# Altium schematic sheet power.SchDoc
size A; SheetNumber: 3; SheetTotal: 3
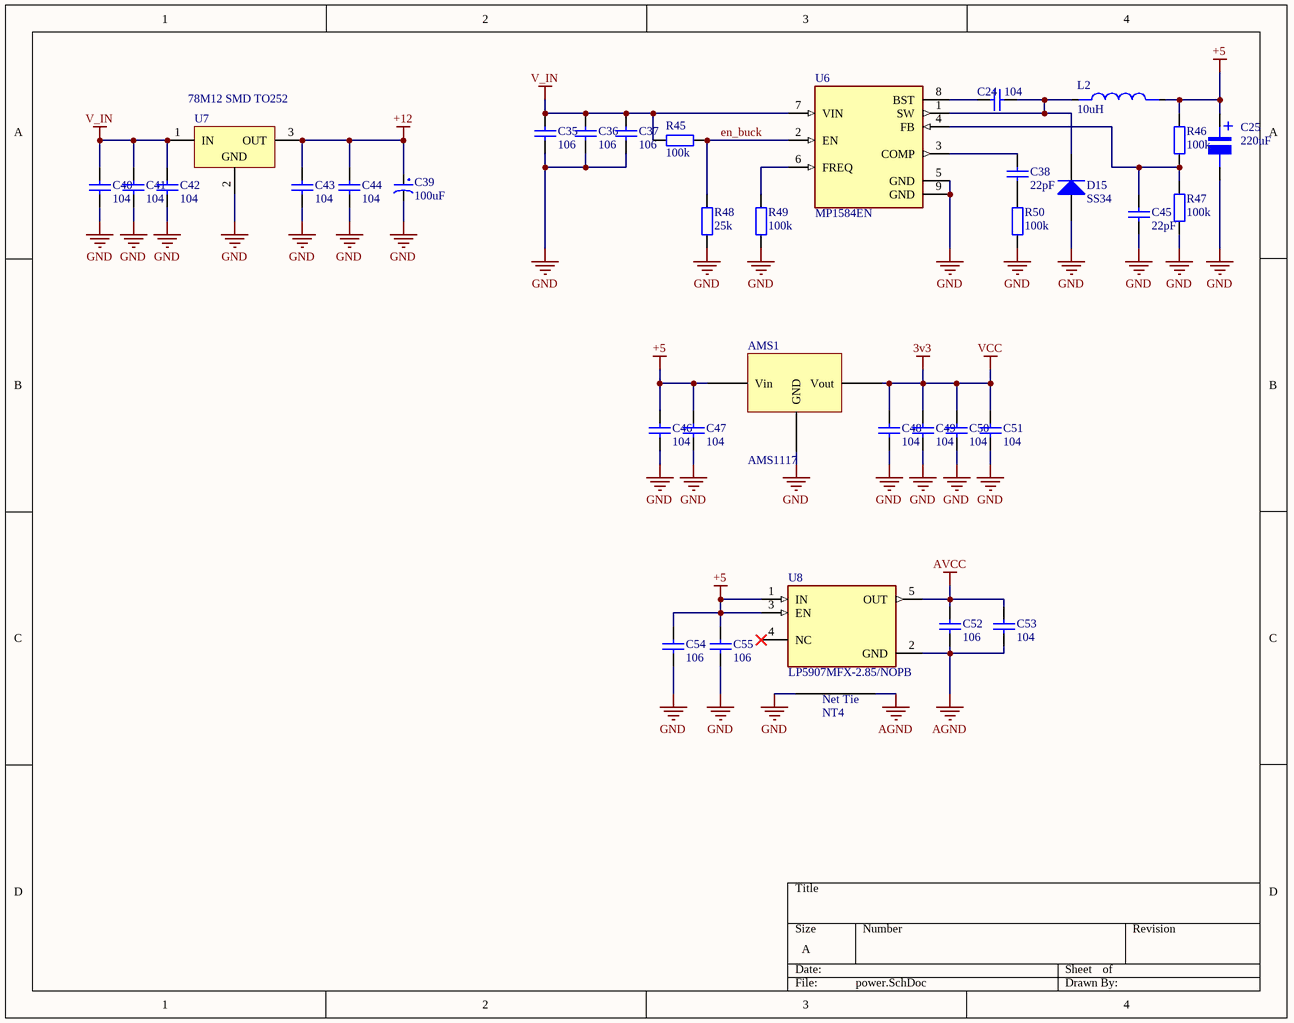
[diagram p0: power.SchDoc]

## Parts
AMS1  AMS1117  [TO 252]
C24  104  [tu 0603]
C25  220uF  [tu nhom 6.3 (d)]
C35  106  [tu 0805]
C36  106  [tu 0805]
C37  106  [tu 0805]
C38  22pF  [tu 0805]
C39  100uF  [tu hoa 8mm]
C40  104  [tu 0603]
C41  104  [tu 0603]
C42  104  [tu 0603]
C43  104  [tu 0603]
C44  104  [tu 0603]
C45  22pF  [tu 0805]
C46  104  [tu 0603]
C47  104  [tu 0603]
C48  104  [tu 0603]
C49  104  [tu 0603]
C50  104  [tu 0603]
C51  104  [tu 0603]
C52  106  [tu 0603]
C53  104  [tu 0603]
C54  106  [tu 0603]
C55  106  [tu 0603]
D15  SS34  [DIODE SMA]
L2  10uH  [CUON CAM SMD 0530]
NT4  2mm  [NetTie_20mil]  (value not drawn)  (net tie, no BOM)
R45  100k  [tro smd 0603]
R46  100k  [tro smd 0603]
R47  100k  [tro smd 0603]
R48  25k  [tro smd 0603]
R49  100k  [tro smd 0603]
R50  100k  [tro smd 0603]
U6  MP1584EN  [SOIC127P600X170-9N]
U7  78M12 SMD TO252  [TO252]
U8  LP5907MFX-2.85/NOPB  [SOT95P280X145-5N]

## Nets
3v3: AMS1.2(Vout) C48.1 C49.1 C50.1 C51.1  [also labelled VCC]
+5: AMS1.3(Vin) C25.1 C46.1 C47.1 C54.1 C55.1 L2.2 R46.2 U8.1(IN) U8.3(EN)
+12: C39.1 C43.1 C44.1 U7.3(OUT)
AGND: C52.2 C53.2 NT4.2 U8.2(GND)
AVCC: C52.1 C53.1 U8.5(OUT)
GND: AMS1.1(GND) C25.2 C35.2 C36.2 C37.2 C39.2 C40.2 C41.2 C42.2 C43.2 C44.2 C45.2 C46.2 C47.2 C48.2 C49.2 C50.2 C51.2 C54.2 C55.2 D15.1(A) NT4.1 R47.1 R48.1 R49.1 R50.1 U6.5(GND) U6.9(GND) U7.2(GND)
V_IN: C35.1 C36.1 C37.1 C40.1 C41.1 C42.1 R45.2 U6.7(VIN) U7.1(IN)
en_buck: R45.1 R48.2 U6.2(EN)
NetC24_1: C24.1 D15.2(K) L2.1 U6.1(SW)
NetC24_2: C24.2 U6.8(BST)
NetC38_1: C38.1 U6.3(COMP)
NetC38_2: C38.2 R50.2
NetC45_1: C45.1 R46.1 R47.2 U6.4(FB)
NetR49_2: R49.2 U6.6(FREQ)

Not connected (* = marked no-connect by the designer): U8 4(NC)*

## Notes on the sheet
- (in symbol NetTie_2mm) Net Tie
- (in symbol Tu Nhom 220uF 16V) +

## Library data of the parts
C24 = Tu 0603 104 50V 10%: Dán; Don_Vi: Con; So_Chan: 2; Ten_Linh_Kien: Tụ 0603 104-100nF 10% 50V; Ma_Hang: MH004568; Chung_Loai: Dán; Kieu_Chan: *
C25 = Tu Nhom 220uF 16V: Dán; Don_Vi: Con; So_Chan: 2; Ten_Linh_Kien: Tụ Nhôm 220uF 16V 6.3x7.7MM; Ma_Hang: MH002227; Chung_Loai: Dán; Kieu_Chan: *
C35-C38 C45 = Tu 0805 106 16V 10%: Dán; Ten_Linh_Kien: Tụ 0805 106-10uF 10% 16V; So_Chan: 2; Don_Vi: Con; Ma_Hang: MH004553; Chung_Loai: Dán; Kieu_Chan: *
C39 = Tu Hoa 100uF 35V 8x11: Cắm; Don_Vi: Con; So_Chan: 2; Ten_Linh_Kien: Tụ Hóa 100uF 35V 8x11MM; Ma_Hang: MH002807; Chung_Loai: Cắm; Kieu_Chan: *
C40-C44 C46-C51 = Tu 0603 101 50V 10%: Dán; Don_Vi: Con; So_Chan: 2; Ten_Linh_Kien: Tụ 0603 101-0.1nF 10% 50V; Ma_Hang: MH004565; Chung_Loai: Dán; Kieu_Chan: *
C52-C55 = Tu 0603 106 16V 20%: Dán; Don_Vi: Con; So_Chan: 2; Ten_Linh_Kien: Tụ 0603-10uF 20% 16V; Ma_Hang: MH004848; Chung_Loai: Dán; Kieu_Chan: *
D15 = Diode SS34 ( 1N5822 ): Dán; Don_Vi: Con; Ma_Hang: MH002104; Ten_Linh_Kien: Diode SS34 3A 40V SMA ( 1N5822 SS34A); Kieu_Chan: *; Chung_Loai: Dán
L2 = Cuon Cam SMD 0530: SMD 0530; MP: FDV0530-H-1R5M=P3; Package: None; Price: None; Value: *; Availability: Unavailable
NT4 = NetTie_2mm
R45-R50 = Tro 0603 1% 0R: Dán; Don_Vi: Con; So_Chan: 2; Ten_Linh_Kien: Trở 0603 1% 0R; Ma_Hang: MH005792; Chung_Loai: Dán; Kieu_Chan: *
U6 = MP1584EN: Buck Switching Regulator IC Positive Adjustable 0.8V 1 Output 3A 8-SOIC (0.154, 3.90mm Width) Exposed Pad; MF: Monolithic Power; SnapEDA_Link: https://www.snapeda.com/parts/MP1584EN/Monolithic+Power+Systems/view-part/?ref=snap; Package: SOIC-8 Monolithic Power; Value: *; MP: MP1584EN; Check_prices: https://www.snapeda.com/parts/MP1584EN/Monolithic+Power+Systems/view-part/?ref=eda
U7 = 78M05 SMD TO252: Dán; Don_Vi: Con; Ten_Linh_Kien: 78M05 TO252; Ma_Hang: MH001917; Ghi_Chu: *; Kieu_Chan: *; Chung_Loai: Dán
U8 = LP5907MFX-2.85/NOPB: 250-mA, low-noise, high-PSRR, ultra-low-dropout voltage regulator with low IQ and enable; MF: Texas Instruments; SnapEDA_Link: https://www.snapeda.com/parts/LP5907MFX-2.85/NOPB/Texas+Instruments/view-part/?ref=snap; Package: SOT-23-5 Texas Instruments; Value: *; MP: LP5907MFX-2.85/NOPB; Check_prices: https://www.snapeda.com/parts/LP5907MFX-2.85/NOPB/Texas+Instruments/view-part/?ref=eda